# Altium schematic sheet RPL_RIO.SchDoc: RIO's Breakout (CAN BUS, +12VDC)
size A; Date: Dec 27, 2017; DrawnBy: Seyed Omid Hasanli; Revision: 1.0; SheetNumber: 11
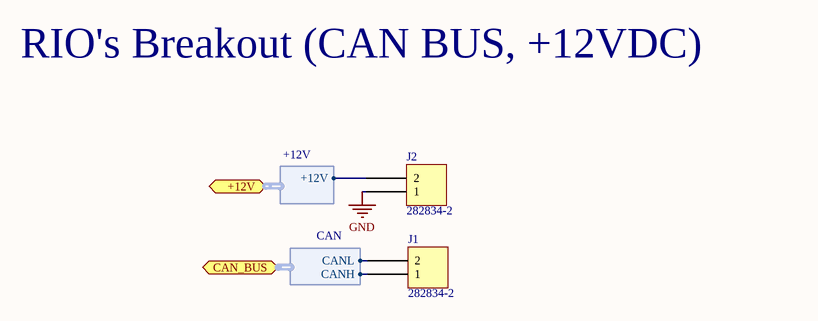
[diagram p0: RPL_RIO.SchDoc]

## Parts
J1  282834-2  [TE 282834-2]
J2  282834-2  [TE 282834-2]

## Ports
+12V (harness +12V), CAN_BUS (harness CAN)

## Harnesses
+12V: +12V
CAN: CANH, CANL

## Nets
GND: J2.1
NetJ1_1: J1.1 ; port CAN_BUS.CANH
NetJ1_2: J1.2 ; port CAN_BUS.CANL
NetJ2_2: J2.2 ; port +12V.+12V

## Notes on the sheet
- RIO's Breakout (CAN BUS, +12VDC)
- Title:
- DrawnBy:
- Revision:
- SheetNumber:
- Date:
- Datasheet Link:

## Library data of the parts
J1 J2 = 282834-2: TERM BLOCK 2POS SIDE ENT 2.54MM; Manufacturer: TE Connectivity AMP Connectors; TemperatureRange: -40C ~ 105C; Voltage: 150V; Pitch: 0.100" (2.54mm); Number Of Levels: 1; Positions Per Level: 2; Part Number: 282834-2; PartId: 9289; Supplier 1: Digi-Key; Supplier Part Number 1: A98333-ND; ComponentLink1Description: Datasheet; ComponentLink1URL: http://www.te.com/commerce/DocumentDelivery/DDEController?Action=srchrtrv&DocNm=282834&DocType=Customer+Drawing&DocLang=English; ComponentLink2Description: Digi-Key Listing; ComponentLink2URL: http://www.digikey.ca/product-detail/en/282834-2/A98333-ND/1150135; Price: 1.3; Colour: Green; Orientation: Horizontal with Board